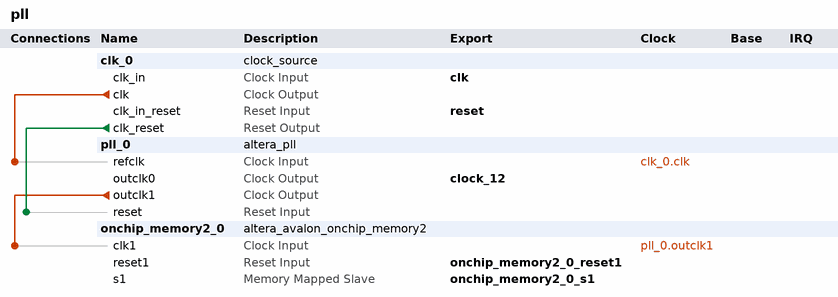
[diagram p0: system contents]
# Platform Designer (Qsys) system pll, Cyclone V 5CSEMA5F31C6
# Parameters at their usual value, and those the tool derives, are not listed.
package require -exact qsys 20.1
create_system pll
set_project_property DEVICE_FAMILY {Cyclone V}
set_project_property DEVICE 5CSEMA5F31C6

add_instance clk_0 clock_source 20.1
set_instance_parameter_value clk_0 clockFrequency 50000000

add_instance pll_0 altera_pll 20.1
set_instance_parameter_value pll_0 gui_device_speed_grade 2
set_instance_parameter_value pll_0 gui_number_of_clocks 2
set_instance_parameter_value pll_0 gui_operation_mode direct
set_instance_parameter_value pll_0 gui_output_clock_frequency0 12.0
set_instance_parameter_value pll_0 gui_output_clock_frequency1 12.0
set_instance_parameter_value pll_0 gui_pll_mode {Integer-N PLL}
set_instance_parameter_value pll_0 gui_reference_clock_frequency 50.0
set_instance_parameter_value pll_0 gui_use_locked false

add_instance onchip_memory2_0 altera_avalon_onchip_memory2 20.1
set_instance_parameter_value onchip_memory2_0 dataWidth 16
set_instance_parameter_value onchip_memory2_0 dualPort false
set_instance_parameter_value onchip_memory2_0 initMemContent true
set_instance_parameter_value onchip_memory2_0 initializationFileName {D:/University/Academic Term 5/ECE 5500 - Digital Systems/MP3 Player/WM8731-Audio-codec-on-DE10Standard-FPGA-board-master/project/compiledShortened.mif}
set_instance_parameter_value onchip_memory2_0 memorySize 256000
set_instance_parameter_value onchip_memory2_0 useNonDefaultInitFile true
set_instance_parameter_value onchip_memory2_0 writable false

# connections
add_connection clk_0.clk pll_0.refclk clock
add_connection pll_0.outclk1 onchip_memory2_0.clk1 clock
add_connection clk_0.clk_reset pll_0.reset reset

# exported interfaces
add_interface clk clock sink
set_interface_property clk EXPORT_OF clk_0.clk_in
add_interface clock_12 clock source
set_interface_property clock_12 EXPORT_OF pll_0.outclk0
add_interface onchip_memory2_0_reset1 reset sink
set_interface_property onchip_memory2_0_reset1 EXPORT_OF onchip_memory2_0.reset1
add_interface onchip_memory2_0_s1 avalon slave
set_interface_property onchip_memory2_0_s1 EXPORT_OF onchip_memory2_0.s1
add_interface reset reset sink
set_interface_property reset EXPORT_OF clk_0.clk_in_reset

set_interconnect_requirement {$system} qsys_mm.clockCrossingAdapter HANDSHAKE
set_interconnect_requirement {$system} qsys_mm.enableEccProtection FALSE
set_interconnect_requirement {$system} qsys_mm.insertDefaultSlave FALSE
set_interconnect_requirement {$system} qsys_mm.maxAdditionalLatency 1

save_system pll.qsys
